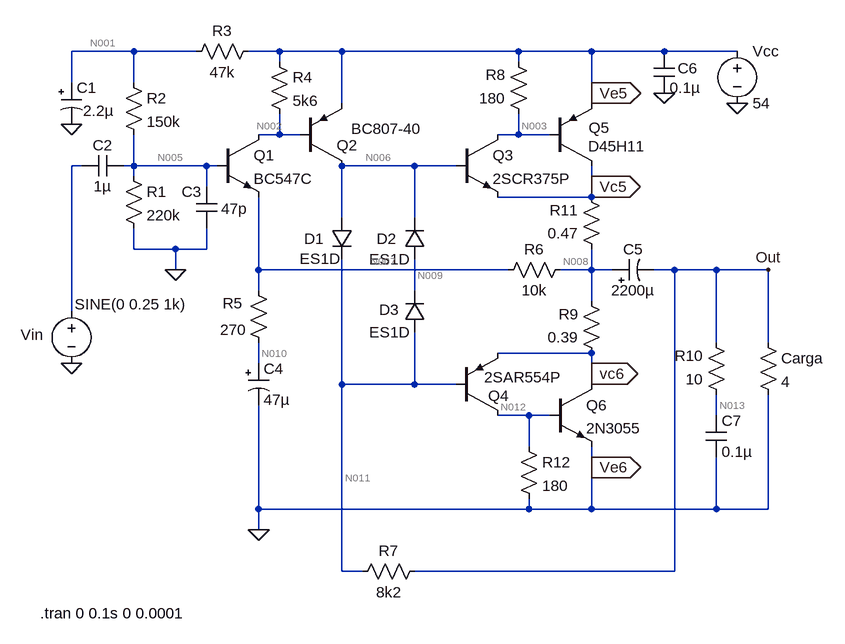
[diagram p0: schematic teste.asc]
teste.asc, the LTspice schematic file:
Version 4
SHEET 1 880 680
WIRE -368 -272 -464 -272
WIRE -272 -272 -368 -272
WIRE -144 -272 -192 -272
WIRE -48 -272 -144 -272
WIRE 224 -272 -48 -272
WIRE 336 -272 224 -272
WIRE 448 -272 336 -272
WIRE 560 -272 448 -272
WIRE -144 -256 -144 -272
WIRE 224 -256 224 -272
WIRE -464 -224 -464 -272
WIRE -368 -224 -368 -272
WIRE 336 -208 336 -272
WIRE -48 -192 -48 -272
WIRE 336 -192 336 -208
WIRE -144 -144 -144 -176
WIRE -144 -144 -176 -144
WIRE -112 -144 -144 -144
WIRE 224 -144 224 -176
WIRE 224 -144 192 -144
WIRE 272 -144 224 -144
WIRE -448 -96 -464 -96
WIRE -368 -96 -368 -144
WIRE -368 -96 -384 -96
WIRE -256 -96 -368 -96
WIRE -240 -96 -256 -96
WIRE 64 -96 -48 -96
WIRE 128 -96 64 -96
WIRE -368 -80 -368 -96
WIRE -256 -64 -256 -96
WIRE 336 -64 336 -96
WIRE 336 -48 336 -64
WIRE 336 -48 192 -48
WIRE -48 -16 -48 -96
WIRE 64 -16 64 -96
WIRE -368 32 -368 0
WIRE -304 32 -368 32
WIRE -256 32 -256 0
WIRE -256 32 -304 32
WIRE -304 64 -304 32
WIRE -176 64 -176 -48
WIRE 208 64 -176 64
WIRE 336 64 336 32
WIRE 336 64 288 64
WIRE 368 64 336 64
WIRE 464 64 432 64
WIRE 528 64 464 64
WIRE 608 64 528 64
WIRE -176 96 -176 64
WIRE 64 96 64 48
WIRE 336 112 336 64
WIRE -464 128 -464 -96
WIRE 528 176 528 64
WIRE 608 176 608 64
WIRE 336 192 192 192
WIRE -176 208 -176 176
WIRE 336 224 336 192
WIRE -48 240 -48 48
WIRE 64 240 64 160
WIRE 64 240 -48 240
WIRE 128 240 64 240
WIRE 336 240 336 224
WIRE 240 288 192 288
WIRE 272 288 240 288
WIRE 528 288 528 256
WIRE 240 336 240 288
WIRE 336 368 336 336
WIRE -176 432 -176 272
WIRE 240 432 240 416
WIRE 240 432 -176 432
WIRE 336 432 336 368
WIRE 336 432 240 432
WIRE 528 432 528 352
WIRE 528 432 336 432
WIRE 608 432 608 256
WIRE 608 432 528 432
WIRE -176 464 -176 432
WIRE -48 528 -48 240
WIRE -16 528 -48 528
WIRE 464 528 464 64
WIRE 464 528 64 528
FLAG -464 -160 0
FLAG 448 -208 0
FLAG -304 64 0
FLAG -176 464 0
FLAG -464 208 0
FLAG 560 -192 0
FLAG 608 64 Out
FLAG 336 -64 Vc5
IOPIN 336 -64 Out
FLAG 336 224 vc6
IOPIN 336 224 Out
FLAG 336 -208 Ve5
IOPIN 336 -208 Out
FLAG 336 368 Ve6
IOPIN 336 368 Out
SYMBOL npn 272 240 R0
SYMATTR InstName Q6
SYMATTR Value 2N3055
SYMBOL npn 128 -144 R0
SYMATTR InstName Q3
SYMATTR Value 2SCR375P
SYMBOL pnp 272 -96 M180
WINDOW 0 60 59 Left 2
WINDOW 3 59 30 Left 2
SYMATTR InstName Q5
SYMATTR Value D45H11
SYMBOL pnp 128 288 M180
WINDOW 0 49 30 Left 2
WINDOW 3 43 59 Left 2
SYMATTR InstName Q4
SYMATTR Value 2SAR554P
SYMBOL pnp -112 -96 M180
WINDOW 3 78 57 Left 2
SYMATTR Value BC807-40
SYMATTR InstName Q2
SYMBOL npn -240 -144 R0
SYMATTR InstName Q1
SYMATTR Value BC547C
SYMBOL diode -64 -16 R0
WINDOW 0 -42 32 Left 2
WINDOW 3 -49 63 Left 2
SYMATTR InstName D1
SYMATTR Value ES1D
SYMBOL diode 80 48 R180
WINDOW 0 44 32 Left 2
WINDOW 3 24 0 Left 2
SYMATTR InstName D2
SYMATTR Value ES1D
SYMBOL diode 80 160 R180
WINDOW 0 40 35 Left 2
WINDOW 3 24 0 Left 2
SYMATTR InstName D3
SYMATTR Value ES1D
SYMBOL res -384 -96 R0
SYMATTR InstName R1
SYMATTR Value 220k
SYMBOL res -384 -240 R0
SYMATTR InstName R2
SYMATTR Value 150k
SYMBOL res -288 -256 R270
WINDOW 0 32 56 VTop 2
WINDOW 3 0 56 VBottom 2
SYMATTR InstName R3
SYMATTR Value 47k
SYMBOL res -160 -272 R0
SYMATTR InstName R4
SYMATTR Value 5k6
SYMBOL res -192 80 R0
WINDOW 0 -39 35 Left 2
WINDOW 3 -43 76 Left 2
SYMATTR InstName R5
SYMATTR Value 270
SYMBOL res 192 80 R270
WINDOW 0 32 56 VTop 2
WINDOW 3 0 56 VBottom 2
SYMATTR InstName R6
SYMATTR Value 10k
SYMBOL res -32 544 R270
WINDOW 0 32 56 VTop 2
WINDOW 3 0 56 VBottom 2
SYMATTR InstName R7
SYMATTR Value 8k2
SYMBOL res 240 -160 R180
WINDOW 0 36 76 Left 2
WINDOW 3 36 40 Left 2
SYMATTR InstName R8
SYMATTR Value 180
SYMBOL res 352 208 R180
WINDOW 0 36 76 Left 2
WINDOW 3 36 40 Left 2
SYMATTR InstName R9
SYMATTR Value 0.39
SYMBOL res 544 272 R180
WINDOW 0 36 76 Left 2
WINDOW 3 36 40 Left 2
SYMATTR InstName R10
SYMATTR Value 10
SYMBOL res 352 48 R180
WINDOW 0 36 76 Left 2
WINDOW 3 36 40 Left 2
SYMATTR InstName R11
SYMATTR Value 0.47
SYMBOL res 224 320 R0
SYMATTR InstName R12
SYMATTR Value 180
SYMBOL polcap -480 -224 R0
WINDOW 3 34 43 Left 2
SYMATTR Value 2.2µ
SYMATTR InstName C1
SYMATTR Description Capacitor
SYMATTR Type cap
SYMATTR SpiceLine V=50 Irms=18m Rser=10 Lser=0 mfg="Nichicon" pn="UPR1H2R2MAH" type="Al electrolytic"
SYMBOL cap -384 -112 R90
WINDOW 0 0 32 VBottom 2
WINDOW 3 32 32 VTop 2
SYMATTR InstName C2
SYMATTR Value 1µ
SYMBOL cap -240 0 R180
WINDOW 0 24 56 Left 2
WINDOW 3 -47 30 Left 2
SYMATTR InstName C3
SYMATTR Value 47p
SYMBOL polcap -192 208 R0
SYMATTR InstName C4
SYMATTR Value 47µ
SYMATTR Description Capacitor
SYMATTR Type cap
SYMATTR SpiceLine V=50 Irms=125m Rser=0.8 Lser=0 mfg="Nichicon" pn="UPR1H470MPH" type="Al electrolytic"
SYMBOL polcap 368 80 R270
WINDOW 0 32 32 VTop 2
WINDOW 3 0 32 VBottom 2
SYMATTR InstName C5
SYMATTR Value 2200µ
SYMATTR Description Capacitor
SYMATTR Type cap
SYMATTR SpiceLine V=50 Irms=2.56 Rser=0.024 Lser=0 mfg="Nichicon" pn="UPL1H222MRH" type="Al electrolytic"
SYMBOL cap 432 -272 R0
WINDOW 0 37 26 Left 2
SYMATTR InstName C6
SYMATTR Value 0.1µ
SYMBOL cap 512 288 R0
SYMATTR InstName C7
SYMATTR Value 0.1µ
SYMBOL res 592 160 R0
SYMATTR InstName Carga
SYMATTR Value 4
SYMBOL voltage -464 112 R0
WINDOW 0 -78 52 Left 2
WINDOW 3 5 5 Left 2
WINDOW 123 0 0 Left 2
WINDOW 39 0 0 Left 2
SYMATTR InstName Vin
SYMATTR Value SINE(0 0.25 1k)
SYMBOL voltage 560 -288 R0
WINDOW 123 0 0 Left 2
WINDOW 39 0 0 Left 2
SYMATTR InstName Vcc
SYMATTR Value 54
TEXT -512 592 Left 2 !.tran 0 0.1s 0 0.0001

The netlist it stands for:
* teste.asc
Q6 vc6 N012 0 0 2N3055
Q3 N003 N006 Vc5 0 2SCR375P
Q5 Vc5 N003 Ve5 0 D45H11
Q4 N012 N011 vc6 0 2SAR554P
Q2 N006 N002 Ve5 0 BC807-40
Q1 N002 N005 N007 0 BC547C
D1 N006 N011 ES1D
D2 N009 N006 ES1D
D3 N011 N009 ES1D
R1 N005 0 220k
R2 N001 N005 150k
R3 N001 Ve5 47k
R4 Ve5 N002 5k6
R5 N007 N010 270
R6 N007 N008 10k
R7 N011 Out 8k2
R8 N003 Ve5 180
R9 vc6 N008 0.39
R10 N013 Out 10
R11 N008 Vc5 0.47
R12 N012 0 180
C1 N001 0 2.2µ V=50 Irms=18m Rser=10 Lser=0 mfg="Nichicon" pn="UPR1H2R2MAH" type="Al electrolytic"
C2 N005 N004 1µ
C3 0 N005 47p
C4 N010 0 47µ V=50 Irms=125m Rser=0.8 Lser=0 mfg="Nichicon" pn="UPR1H470MPH" type="Al electrolytic"
C5 N008 Out 2200µ V=50 Irms=2.56 Rser=0.024 Lser=0 mfg="Nichicon" pn="UPL1H222MRH" type="Al electrolytic"
C6 Ve5 0 0.1µ
C7 N013 0 0.1µ
R§Carga Out 0 4
Vin N004 0 SINE(0 0.25 1k)
Vcc Ve5 0 54
.model D D
.lib standard.dio
.model NPN NPN
.model PNP PNP
.lib standard.bjt
.tran 0 0.1s 0 0.0001
.backanno
.end

* Results of the author's LTspice run, read from the files saved beside the schematic
* Operating Point, zero values left out:
*   V(vc6) = 26.81 V
*   V(n012) = 19.88 mV
*   V(n003) = 54 V
*   V(n006) = 26.78 V
*   V(vc5) = 26.81 V
*   V(ve5) = 54 V
*   V(n011) = 26.32 V
*   V(n002) = 53.41 V
*   V(n005) = 28.47 V
*   V(n007) = 27.92 V
*   V(n009) = 26.55 V
*   V(n001) = 47.91 V
*   V(n010) = 27.92 V
*   V(n008) = 26.81 V
*   V(out) = 12.83 mV
*   V(n013) = 12.83 mV
*   Ic(Q1) = 110.7 µA
*   Ib(Q1) = 166 nA
*   Ie(Q1) = -110.8 µA
*   Ic(Q2) = -3.208 mA
*   Ib(Q2) = -4.516 µA
*   Ie(Q2) = 3.213 mA
*   Ic(Q4) = -110.4 µA
*   Ib(Q4) = -321.4 nA
*   Ie(Q4) = 110.8 µA
*   Ic(Q5) = -347.1 pA
*   Ib(Q5) = 67.5 pA
*   Ie(Q5) = 284.1 pA
*   Ic(Q3) = 154.4 pA
*   Ib(Q3) = -153.4 pA
*   Ic(Q6) = 60.06 nA
*   Ib(Q6) = -8.561 nA
*   Ie(Q6) = -51.5 nA
*   I(D3) = -493.8 nA
*   I(D2) = -493.8 nA
*   I(D1) = 3.208 mA
*   I(Carga) = 3.209 mA
*   I(R12) = 110.5 µA
*   I(R11) = -348 pA
*   I(R9) = -110.8 µA
*   I(R8) = -222 pA
*   I(R7) = 3.209 mA
*   I(R6) = 110.8 µA
*   I(R4) = 106.1 µA
*   I(R3) = -129.6 µA
*   I(R2) = 129.6 µA
*   I(R1) = 129.4 µA
*   I(Vcc) = -3.448 mA